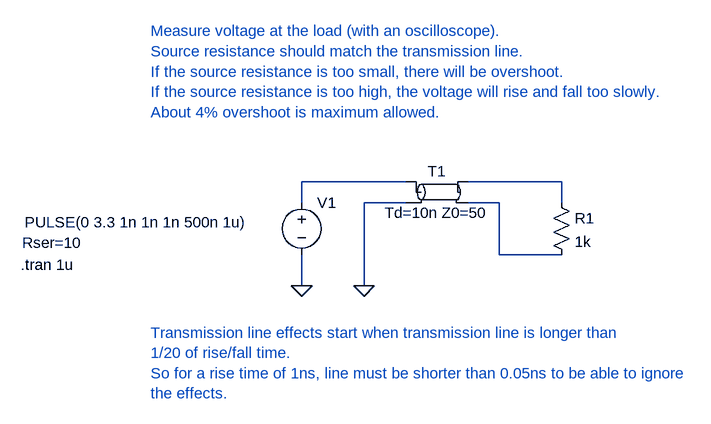
[diagram p0: schematic TransmissionLine.asc]
TransmissionLine.asc, the LTspice schematic file:
Version 4
SHEET 1 1036 680
WIRE 256 112 96 112
WIRE 496 112 352 112
WIRE 96 144 96 112
WIRE 256 144 192 144
WIRE 400 144 352 144
WIRE 496 144 496 112
WIRE 400 224 400 144
WIRE 496 224 400 224
WIRE 96 272 96 224
WIRE 192 272 192 144
FLAG 96 272 0
FLAG 192 272 0
SYMBOL voltage 96 128 R0
WINDOW 3 -426 46 Left 2
WINDOW 123 0 0 Left 0
WINDOW 39 -430 78 Left 2
SYMATTR InstName V1
SYMATTR Value PULSE(0 3.3 1n 1n 1n 500n 1u)
SYMATTR SpiceLine Rser=10
SYMBOL tline 304 128 R0
SYMATTR InstName T1
SYMATTR Value Td=10n Z0=50
SYMBOL res 480 128 R0
SYMATTR InstName R1
SYMATTR Value 1k
TEXT -336 240 Left 2 !.tran 1u
TEXT -136 -120 Left 2 ;Measure voltage at the load (with an oscilloscope).\nSource resistance should match the transmission line.\nIf the source resistance is too small, there will be overshoot.\nIf the source resistance is too high, the voltage will rise and fall too slowly.\nAbout 4% overshoot is maximum allowed.
TEXT -136 344 Left 2 ;Transmission line effects start when transmission line is longer than \n1/20 of rise/fall time.\nSo for a rise time of 1ns, line must be shorter than 0.05ns to be able to ignore\nthe effects.

The netlist it stands for:
* TransmissionLine.asc
V1 N001 0 PULSE(0 3.3 1n 1n 1n 500n 1u) Rser=10
T1 N001 0 N002 N003 Td=10n Z0=50
R1 N002 N003 1k
.tran 1u
* Measure voltage at the load (with an oscilloscope).
* Source resistance should match the transmission line.
* If the source resistance is too small, there will be overshoot.
* If the source resistance is too high, the voltage will rise and fall too slowly.
* About 4% overshoot is maximum allowed.
* Transmission line effects start when transmission line is longer than
* 1/20 of rise/fall time.
* So for a rise time of 1ns, line must be shorter than 0.05ns to be able to ignore
* the effects.
.backanno
.end